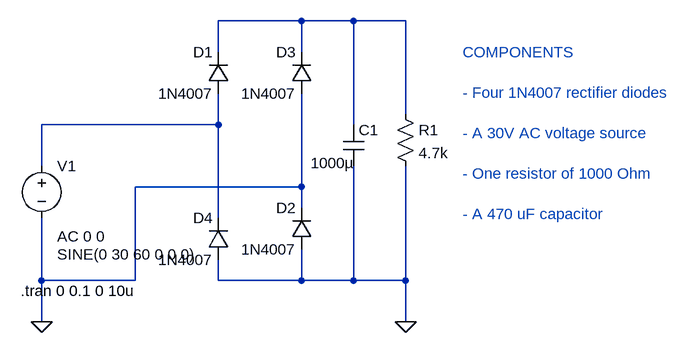
[diagram p0: schematic monofasico.asc]
monofasico.asc, the LTspice schematic file:
Version 4.1
SHEET 1 880 680
WIRE -144 -208 -272 -208
WIRE -64 -208 -144 -208
WIRE 16 -208 -64 -208
WIRE -272 -160 -272 -208
WIRE -144 -160 -144 -208
WIRE 16 -64 16 -208
WIRE -272 -48 -272 -96
WIRE -272 -48 -544 -48
WIRE -64 -48 -64 -208
WIRE -544 16 -544 -48
WIRE -144 48 -144 -96
WIRE -144 48 -400 48
WIRE -144 80 -144 48
WIRE -272 96 -272 -48
WIRE -544 192 -544 96
WIRE -400 192 -400 48
WIRE -400 192 -544 192
WIRE -272 192 -272 160
WIRE -144 192 -144 144
WIRE -144 192 -272 192
WIRE -64 192 -64 16
WIRE -64 192 -144 192
WIRE 16 192 16 16
WIRE 16 192 -64 192
WIRE -544 256 -544 192
WIRE 16 256 16 192
FLAG -544 256 0
FLAG 16 256 0
SYMBOL voltage -544 0 R0
WINDOW 3 24 152 Left 2
WINDOW 123 24 124 Left 2
WINDOW 39 0 0 Left 0
SYMATTR InstName V1
SYMATTR Value SINE(0 30 60 0 0 0)
SYMATTR Value2 AC 0 0
SYMBOL diode -256 -96 R180
WINDOW 0 24 64 Left 2
WINDOW 3 24 0 Left 2
SYMATTR InstName D1
SYMATTR Value 1N4007
SYMBOL res 0 -80 R0
SYMATTR InstName R1
SYMATTR Value 4.7k
SYMBOL diode -128 144 R180
WINDOW 0 24 64 Left 2
WINDOW 3 24 0 Left 2
SYMATTR InstName D2
SYMATTR Value 1N4007
SYMBOL diode -128 -96 R180
WINDOW 0 24 64 Left 2
WINDOW 3 24 0 Left 2
SYMATTR InstName D3
SYMATTR Value 1N4007
SYMBOL diode -256 160 R180
WINDOW 0 24 64 Left 2
WINDOW 3 24 0 Left 2
SYMATTR InstName D4
SYMATTR Value 1N4007
SYMBOL cap -80 -48 R0
WINDOW 3 -50 59 Left 2
SYMATTR InstName C1
SYMATTR Value 1000µ
SYMATTR SpiceLine V=63
TEXT 104 -160 Left 2 ;COMPONENTS\n \n- Four 1N4007 rectifier diodes\n \n- A 30V AC voltage source\n \n- One resistor of 1000 Ohm\n \n- A 470 uF capacitor
TEXT -576 208 Left 2 !.tran 0 0.1 0 10u

The netlist it stands for:
* monofasico.asc
V1 N002 0 SINE(0 30 60 0 0 0) AC 0 0
D1 N002 N001 1N4007
R1 N001 0 4.7k
D2 0 0 1N4007
D3 0 N001 1N4007
D4 0 N002 1N4007
C1 N001 0 1000µ V=63
.model D D
.lib standard.dio
* COMPONENTS
* - Four 1N4007 rectifier diodes
* - A 30V AC voltage source
* - One resistor of 1000 Ohm
* - A 470 uF capacitor
.tran 0 0.1 0 10u
.backanno
.end